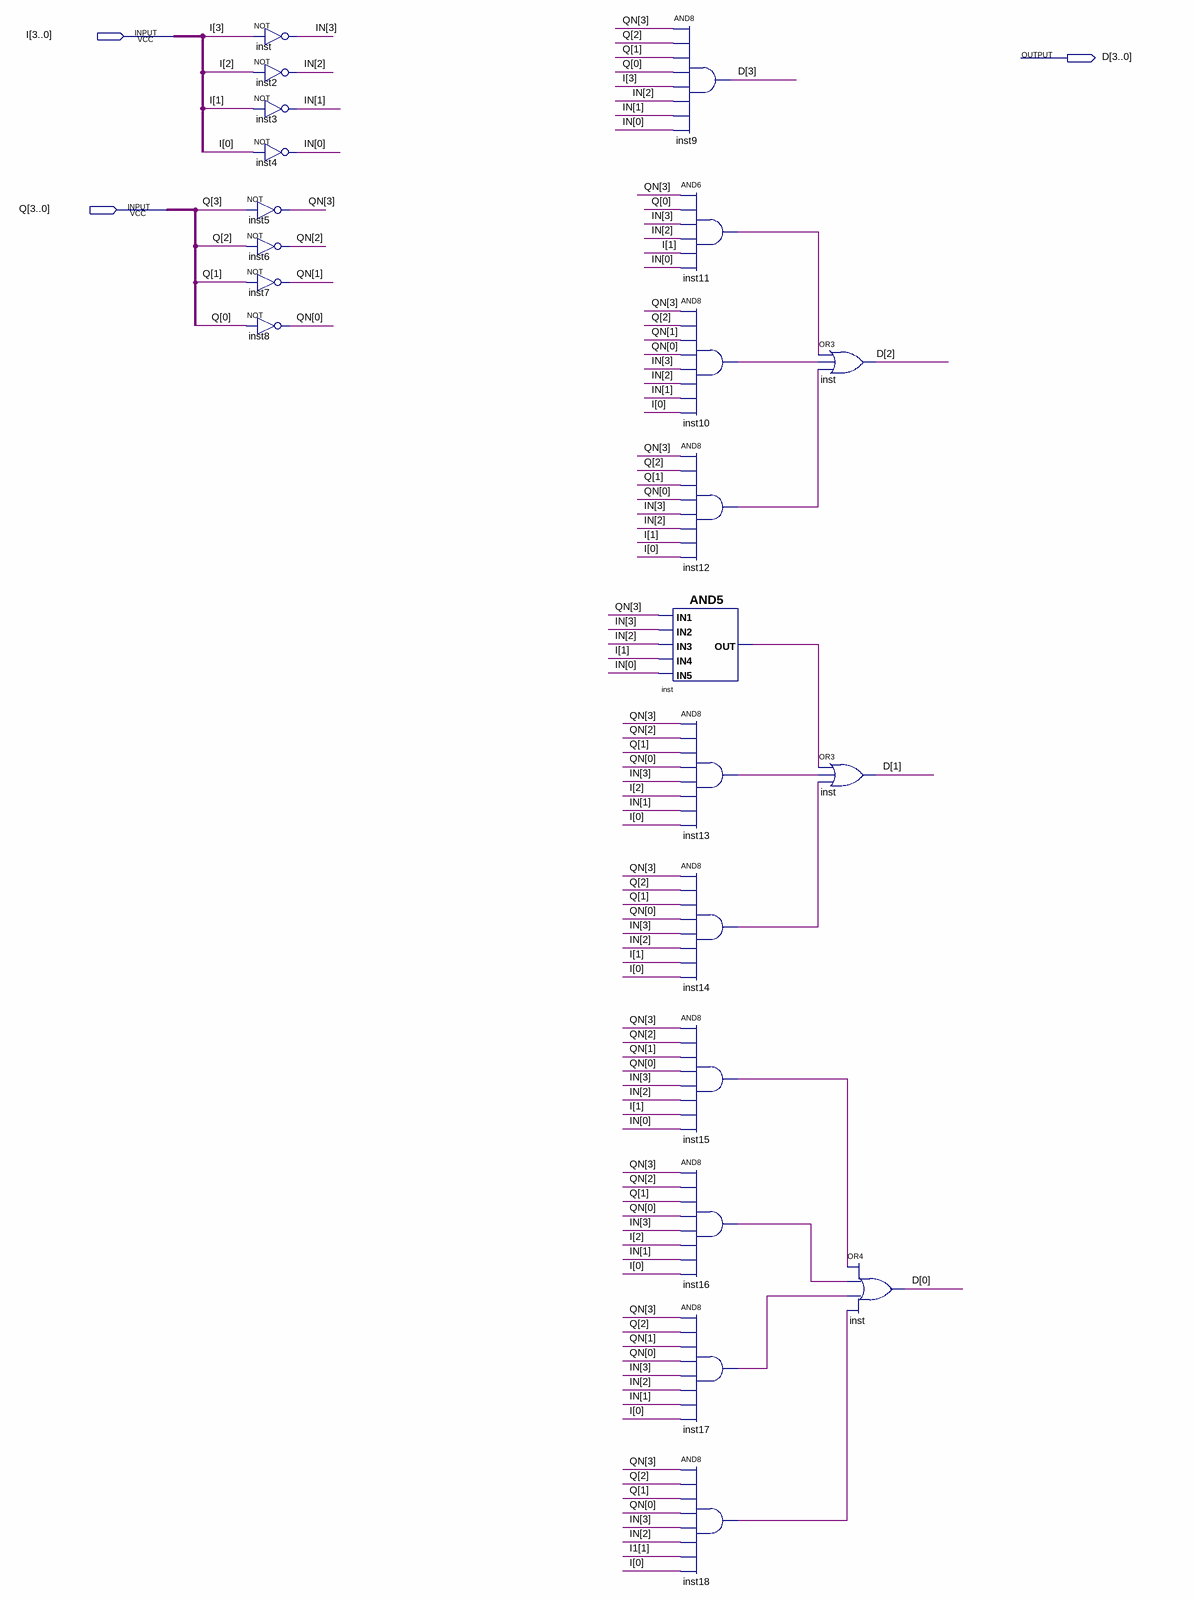
[diagram p0: schematic sheet]
// Quartus schematic NEXT_STAGE.bdf as structural Verilog: 22 symbols, 3 pins
module NEXT_STAGE (
  input  [3:0] I,
  input  [3:0] Q,
  output [3:0] D
);

  wire inst10_out, inst11_out, inst12_out, inst13_out, inst14_out, inst15_out, inst16_out, inst17_out,
       inst18_out, inst_out;
  wire [1:1] I1;
  wire [3:0] IN, QN;

  not inst (IN[3], I[3]);
  not inst2 (IN[2], I[2]);
  not inst3 (IN[1], I[1]);
  not inst4 (IN[0], I[0]);
  not inst5 (QN[3], Q[3]);
  not inst6 (QN[2], Q[2]);
  not inst7 (QN[1], Q[1]);
  not inst8 (QN[0], Q[0]);
  and inst9 (D[3], QN[3], Q[2], Q[1], Q[0], I[3], IN[2], IN[1], IN[0]);
  and inst11 (inst11_out, QN[3], Q[0], IN[3], IN[2], I[1], IN[0]);
  and inst10 (inst10_out, QN[3], Q[2], QN[1], QN[0], IN[3], IN[2], IN[1], I[0]);
  and inst12 (inst12_out, QN[3], Q[2], Q[1], QN[0], IN[3], IN[2], I[1], I[0]);
  and inst_dup2 (inst_out, QN[3], IN[3], IN[2], I[1], IN[0]);
  and inst13 (inst13_out, QN[3], QN[2], Q[1], QN[0], IN[3], I[2], IN[1], I[0]);
  and inst14 (inst14_out, QN[3], Q[2], Q[1], QN[0], IN[3], IN[2], I[1], I[0]);
  and inst15 (inst15_out, QN[3], QN[2], QN[1], QN[0], IN[3], IN[2], I[1], IN[0]);
  and inst16 (inst16_out, QN[3], QN[2], Q[1], QN[0], IN[3], I[2], IN[1], I[0]);
  and inst17 (inst17_out, QN[3], Q[2], QN[1], QN[0], IN[3], IN[2], IN[1], I[0]);
  and inst18 (inst18_out, QN[3], Q[2], Q[1], QN[0], IN[3], IN[2], I1[1], I[0]);
  or inst_dup3 (D[2], inst11_out, inst10_out, inst12_out);
  or inst_dup4 (D[1], inst_out, inst13_out, inst14_out);
  or inst_dup5 (D[0], inst15_out, inst16_out, inst17_out, inst18_out);
endmodule
